# EAGLE schematic ModuloSlave (EAGLE 7.5.0)
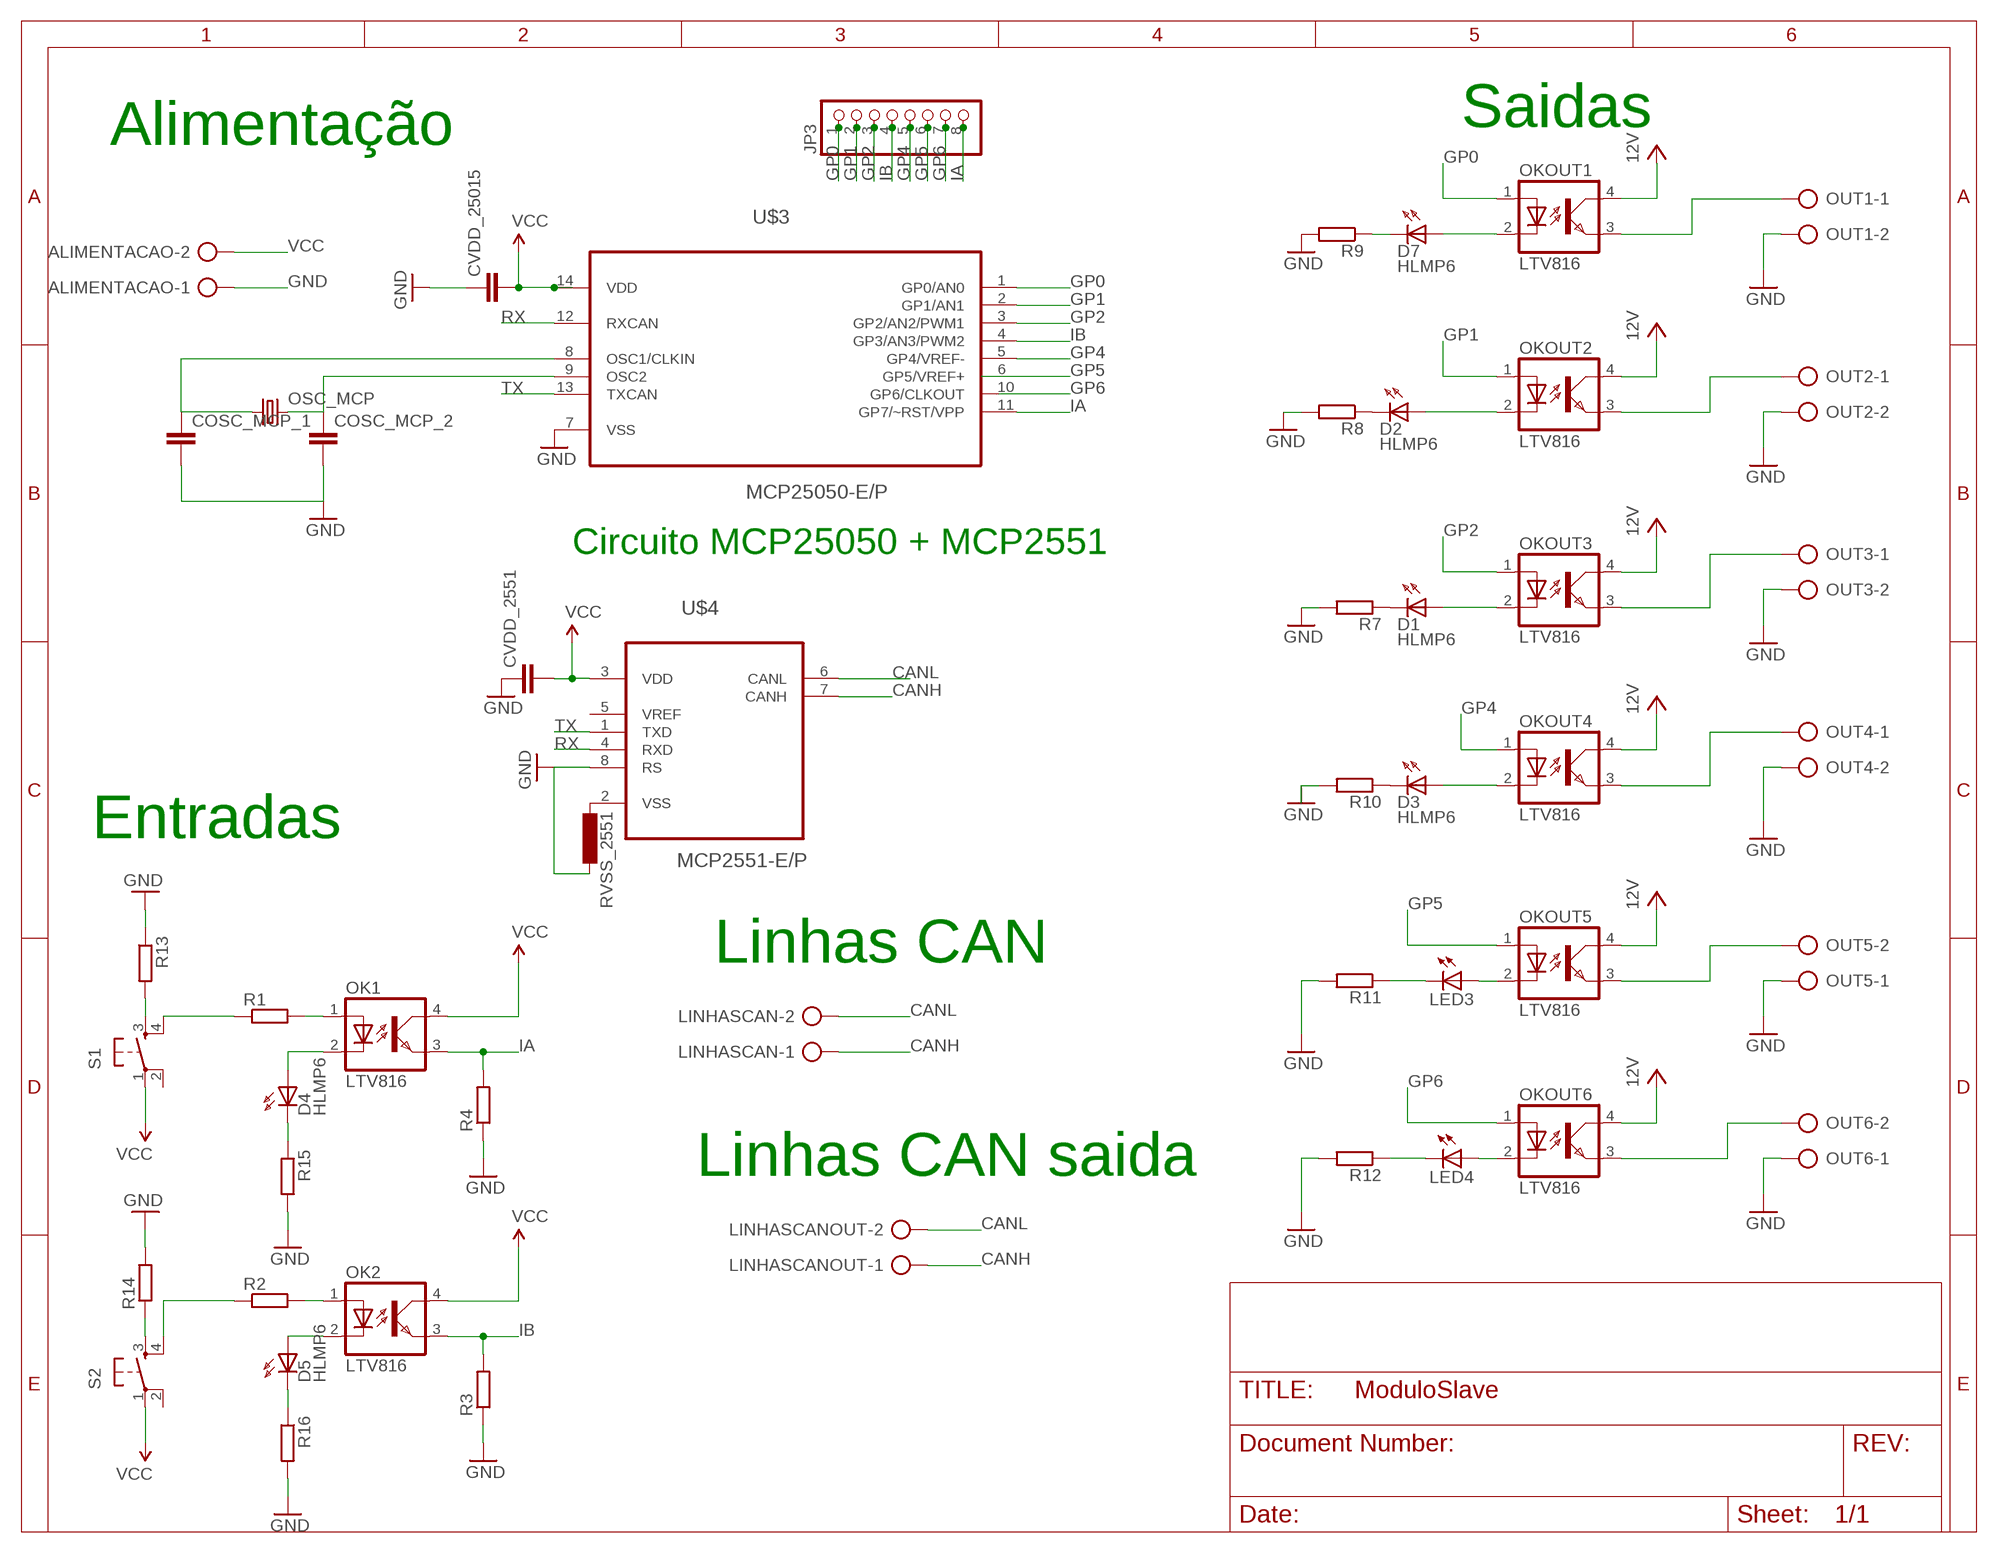
[diagram p0: schematic, sheet 1]

## Parts
ALIMENTACAO  AK300/2  [AK300/2]
COSC_MCP_1  CAP_  [AXIAL-5MM]
COSC_MCP_2  CAP_  [AXIAL-5MM]
CVDD_2551  CAP_  [AXIAL-5MM]
CVDD_25015  CAP_  [AXIAL-5MM]
D1  HLMP6  [HLMP6]
D2  HLMP6  [HLMP6]
D3  HLMP6  [HLMP6]
D4  HLMP6  [HLMP6]
D5  HLMP6  [HLMP6]
D7  HLMP6  [HLMP6]
JP3  PINHD-1X8  [1X08]
LED3  LED_E  [LED_1206]
LED4  LED_E  [LED_1206]
LINHASCAN  AK300/2  [AK300/2]
LINHASCANOUT  AK300/2  [AK300/2]
OK1  LTV816  [DIL04]
OK2  LTV816  [DIL04]
OKOUT1  LTV816  [DIL04]
OKOUT2  LTV816  [DIL04]
OKOUT3  LTV816  [DIL04]
OKOUT4  LTV816  [DIL04]
OKOUT5  LTV816  [DIL04]
OKOUT6  LTV816  [DIL04]
OSC_MCP  CRYSTALHC49S  [HC49/S]
OUT1  AK300/2  [AK300/2]
OUT2  AK300/2  [AK300/2]
OUT3  AK300/2  [AK300/2]
OUT4  AK300/2  [AK300/2]
OUT5  AK300/2  [AK300/2]
OUT6  AK300/2  [AK300/2]
R1  R-EU_0204/5  [0204/5]
R2  R-EU_0204/5  [0204/5]
R3  R-EU_0204/5  [0204/5]
R4  R-EU_0204/5  [0204/5]
R7  R-EU_0204/5  [0204/5]
R8  R-EU_0204/5  [0204/5]
R9  R-EU_0204/5  [0204/5]
R10  R-EU_0204/5  [0204/5]
R11  R-EU_0204/5  [0204/5]
R12  R-EU_0204/5  [0204/5]
R13  R-EU_0204/5  [0204/5]
R14  R-EU_0204/5  [0204/5]
R15  R-EU_0204/5  [0204/5]
R16  R-EU_0204/5  [0204/5]
RVSS_2551  L-EU0204V  [0204V]
S1  TAC_SWITCHPTH  [TACTILE-PTH]
S2  TAC_SWITCHPTH  [TACTILE-PTH]
U$3  MCP25050-E/P  [DIP254P762X432-14]
U$4  MCP2551-E/P  [DIP254P762X432-8]

## Nets
CANH: LINHASCAN.1 LINHASCANOUT.1 U$4.7(CANH)
CANL: LINHASCAN.2 LINHASCANOUT.2 U$4.6(CANL)
GND: ALIMENTACAO.1 COSC_MCP_1.P$2 COSC_MCP_2.P$2 CVDD_2551.P$1 CVDD_25015.P$1 OUT1.2 OUT2.2 OUT3.2 OUT4.2 OUT5.1 OUT6.1 R3.1 R4.1 R7.2 R8.2 R9.2 R10.2 R11.2 R12.2 R13.1 R14.2 R15.2 R16.2 RVSS_2551.1 U$3.7(VSS) U$4.8(RS)
GP0: JP3.1 OKOUT1.1(A) U$3.1(GP0/AN0)
GP1: JP3.2 OKOUT2.1(A) U$3.2(GP1/AN1)
GP2: JP3.3 OKOUT3.1(A) U$3.3(GP2/AN2/PWM1)
GP4: JP3.5 OKOUT4.1(A) U$3.5(GP4/VREF-)
GP5: JP3.6 OKOUT5.1(A)
GP6: JP3.7 OKOUT6.1(A)
IA: JP3.8 OK1.3(EMIT) R4.2 U$3.11(GP7/~RST/VPP)
IB: JP3.4 OK2.3(EMIT) R3.2 U$3.4(GP3/AN3/PWM2)
N$1: D7.A OKOUT1.2(C)
N$2: D1.A OKOUT3.2(C)
N$3: D7.K R9.1
N$4: D1.K R7.1
N$5: D2.K R8.1
N$6: D3.K R10.1
N$7: OK2.1(A) R2.2
N$8: OK1.1(A) R1.2
N$9: R13.2 S1.3
N$10: RVSS_2551.2 U$4.2(VSS)
N$11: R14.1 S2.3
N$12: R2.1 S2.4
N$13: COSC_MCP_1.P$1 OSC_MCP.1 U$3.8(OSC1/CLKIN)
N$14: COSC_MCP_2.P$1 OSC_MCP.2 U$3.9(OSC2)
N$15: OKOUT1.3(EMIT) OUT1.1
N$16: OKOUT2.3(EMIT) OUT2.1
N$17: R1.1 S1.4
N$18: D5.A OK2.2(C)
N$19: D5.K R16.1
N$21: D4.A OK1.2(C)
N$22: D4.K R15.1
N$23: LED3.C R11.1
N$24: D2.A OKOUT2.2(C)
N$25: OKOUT3.3(EMIT) OUT3.1
N$26: LED4.C R12.1
N$27: OKOUT4.3(EMIT) OUT4.1
N$28: LED4.A OKOUT6.2(C)
N$29: OKOUT5.3(EMIT) OUT5.2
N$30: LED3.A OKOUT5.2(C)
N$31: OKOUT6.3(EMIT) OUT6.2
N$33: D3.A OKOUT4.2(C)
RX: U$3.12(RXCAN) U$4.4(RXD)
TX: U$3.13(TXCAN) U$4.1(TXD)
VCC: ALIMENTACAO.2 CVDD_2551.P$2 CVDD_25015.P$2 OK1.4(COL) OK2.4(COL) OKOUT1.4(COL) OKOUT2.4(COL) OKOUT3.4(COL) OKOUT4.4(COL) OKOUT5.4(COL) OKOUT6.4(COL) S1.1 S2.1 U$3.14(VDD) U$4.3(VDD) ; supply symbol labelled 12V
Unconnected: S1.2 S2.2 U$3.6(GP5/VREF+) U$3.10(GP6/CLKOUT) U$4.5(VREF)

## Notes on the sheet
- Alimentação | Saidas
- Circuito MCP25050 + MCP2551
- Entradas
- Linhas CAN
- Linhas CAN saida

## Library data of the parts
ALIMENTACAO LINHASCAN LINHASCANOUT OUT1-OUT6 = con-ptr500:AK300/2: CONNECTOR; OC_FARNELL: unknown; OC_NEWARK: unknown
COSC_MCP_1 COSC_MCP_2 CVDD_2551 CVDD_25015 = SparkFun-Passives:CAP: Capacitor Standard 0603 ceramic capacitor, and 0.1" leaded capacitor.
D1-D5 D7 = display-hp:HLMP6: LED 2mm horizontal; MF: AGILENT TECHNOLOGIES; MPN: HLMP-6500; OC_FARNELL: 1652490; OC_NEWARK: 40K0088
JP3 = pinhead:PINHD-1X8: PIN HEADER
LED3 LED4 = eagle-ltspice:LED_E: LED Source: http://www.osram.convergy.de Source: www.luxeon.com Source: www.kingbright.com; SPICEMODEL: NONE; SPICEPREFIX: D; SPICETYPE: diode
OK1 OK2 OKOUT1-OKOUT6 = optocoupler:LTV816: OPTO COUPLER Source: LITEON, LTV816.pdf; OC_FARNELL: unknown; OC_NEWARK: unknown
OSC_MCP = crystal:CRYSTAL: CRYSTAL; OC_FARNELL: 1667008; OC_NEWARK: unknown
R1-R4 R7-R16 = resistor:R-EU_: RESISTOR, European symbol
RVSS_2551 = rcl:L-EU: INDUCTOR, European symbol
S1 S2 = SparkFun-Retired:TAC_SWITCH: Momentary Switch Button commonly used for reset or general input. Spark Fun Electronics SKU : COM-00097 SMT- SWCH-08247
U$3 = Microchip_By_element14_Batch_1:MCP25050-E/P: CAN I/O Expander Family; MPN: MCP25050-E/P; OC_FARNELL: 1467677; OC_NEWARK: 92C4178; PACKAGE: DIP-14; SUPPLIER: Microchip
U$4 = Microchip_By_element14_Batch_1:MCP2551-E/P: High-Speed CAN Transceiver; MPN: MCP2551-E/P; OC_FARNELL: 1439745; OC_NEWARK: 69K7603; PACKAGE: DIP-8; SUPPLIER: Microchip